# EasyEDA Pro project ProPrj_ProDoc_FPGA_2026-03-24.epro, schematic SCH_13, sheets 6 to 11 of 11

## Sheets
6 FPGA_ DDR3: Board Name: 第五版; Create Date: 2024-10-14; Page Name: FPGA_ DDR3; Project Name: FPGA+MCU核心板10-14; Schematic Name: SCH_10; Update Date: 2024-10-14
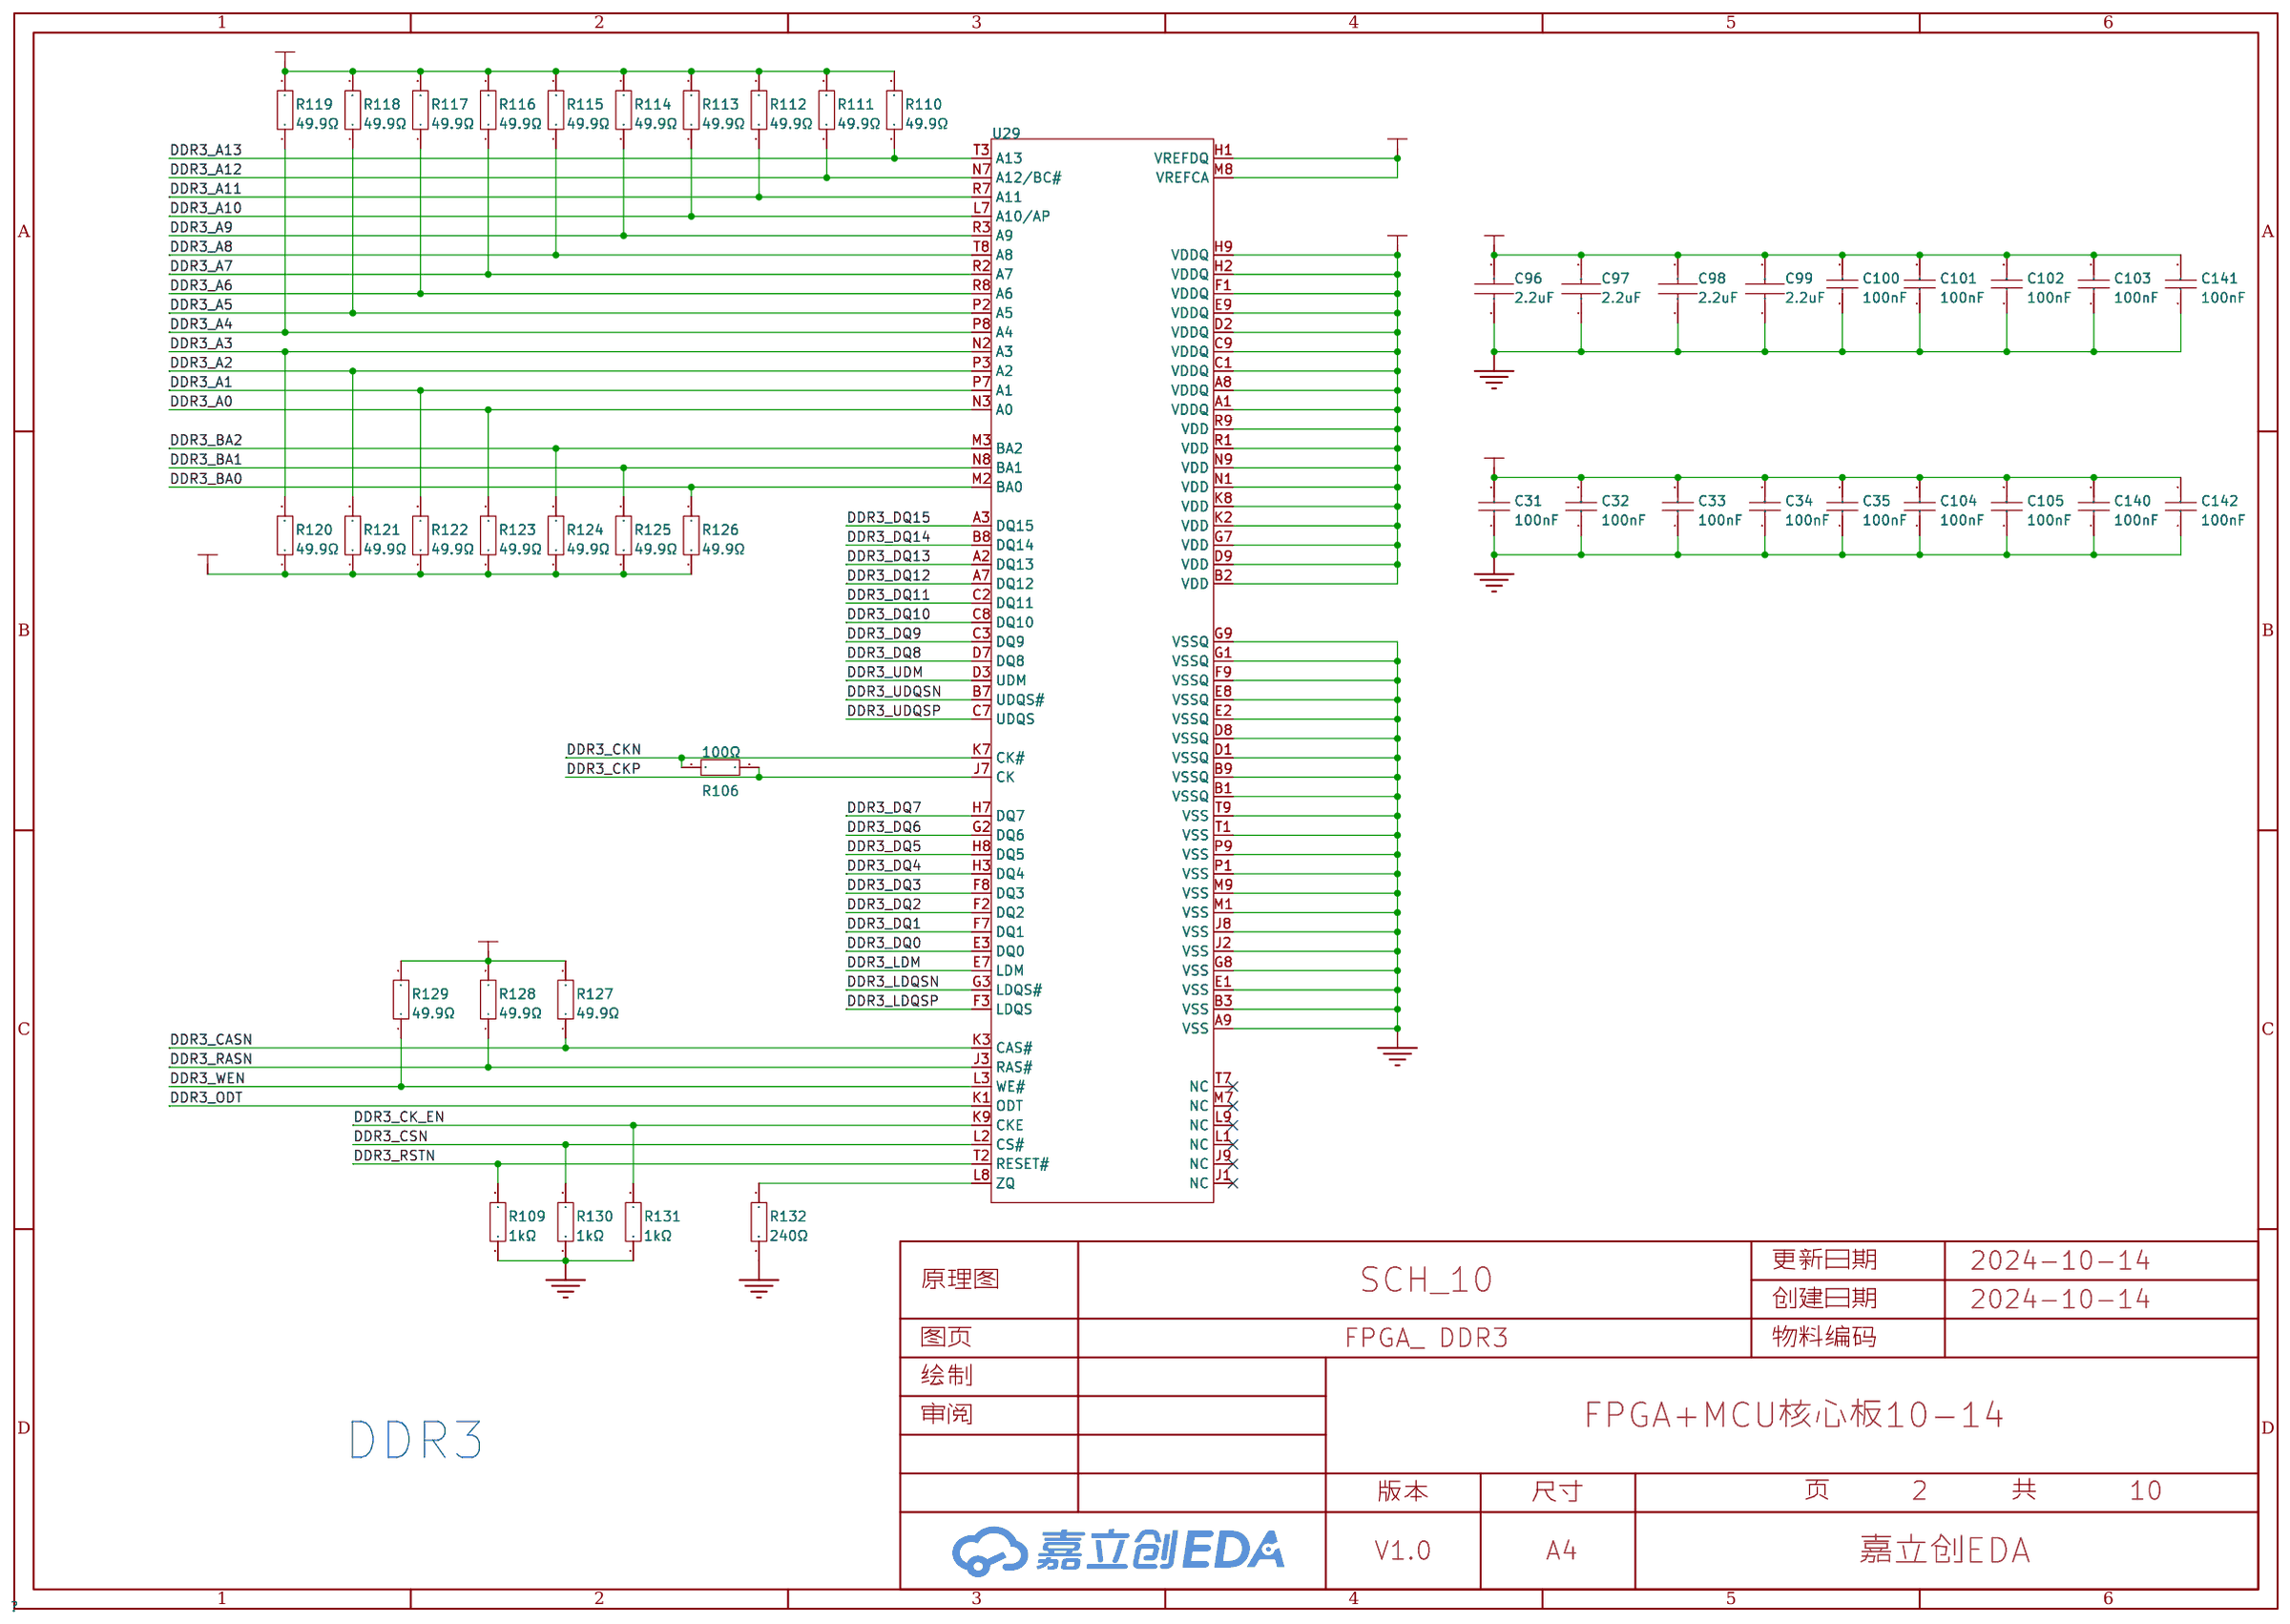
[diagram p5: FPGA_ DDR3]
7 FPGA_DDR3_Power
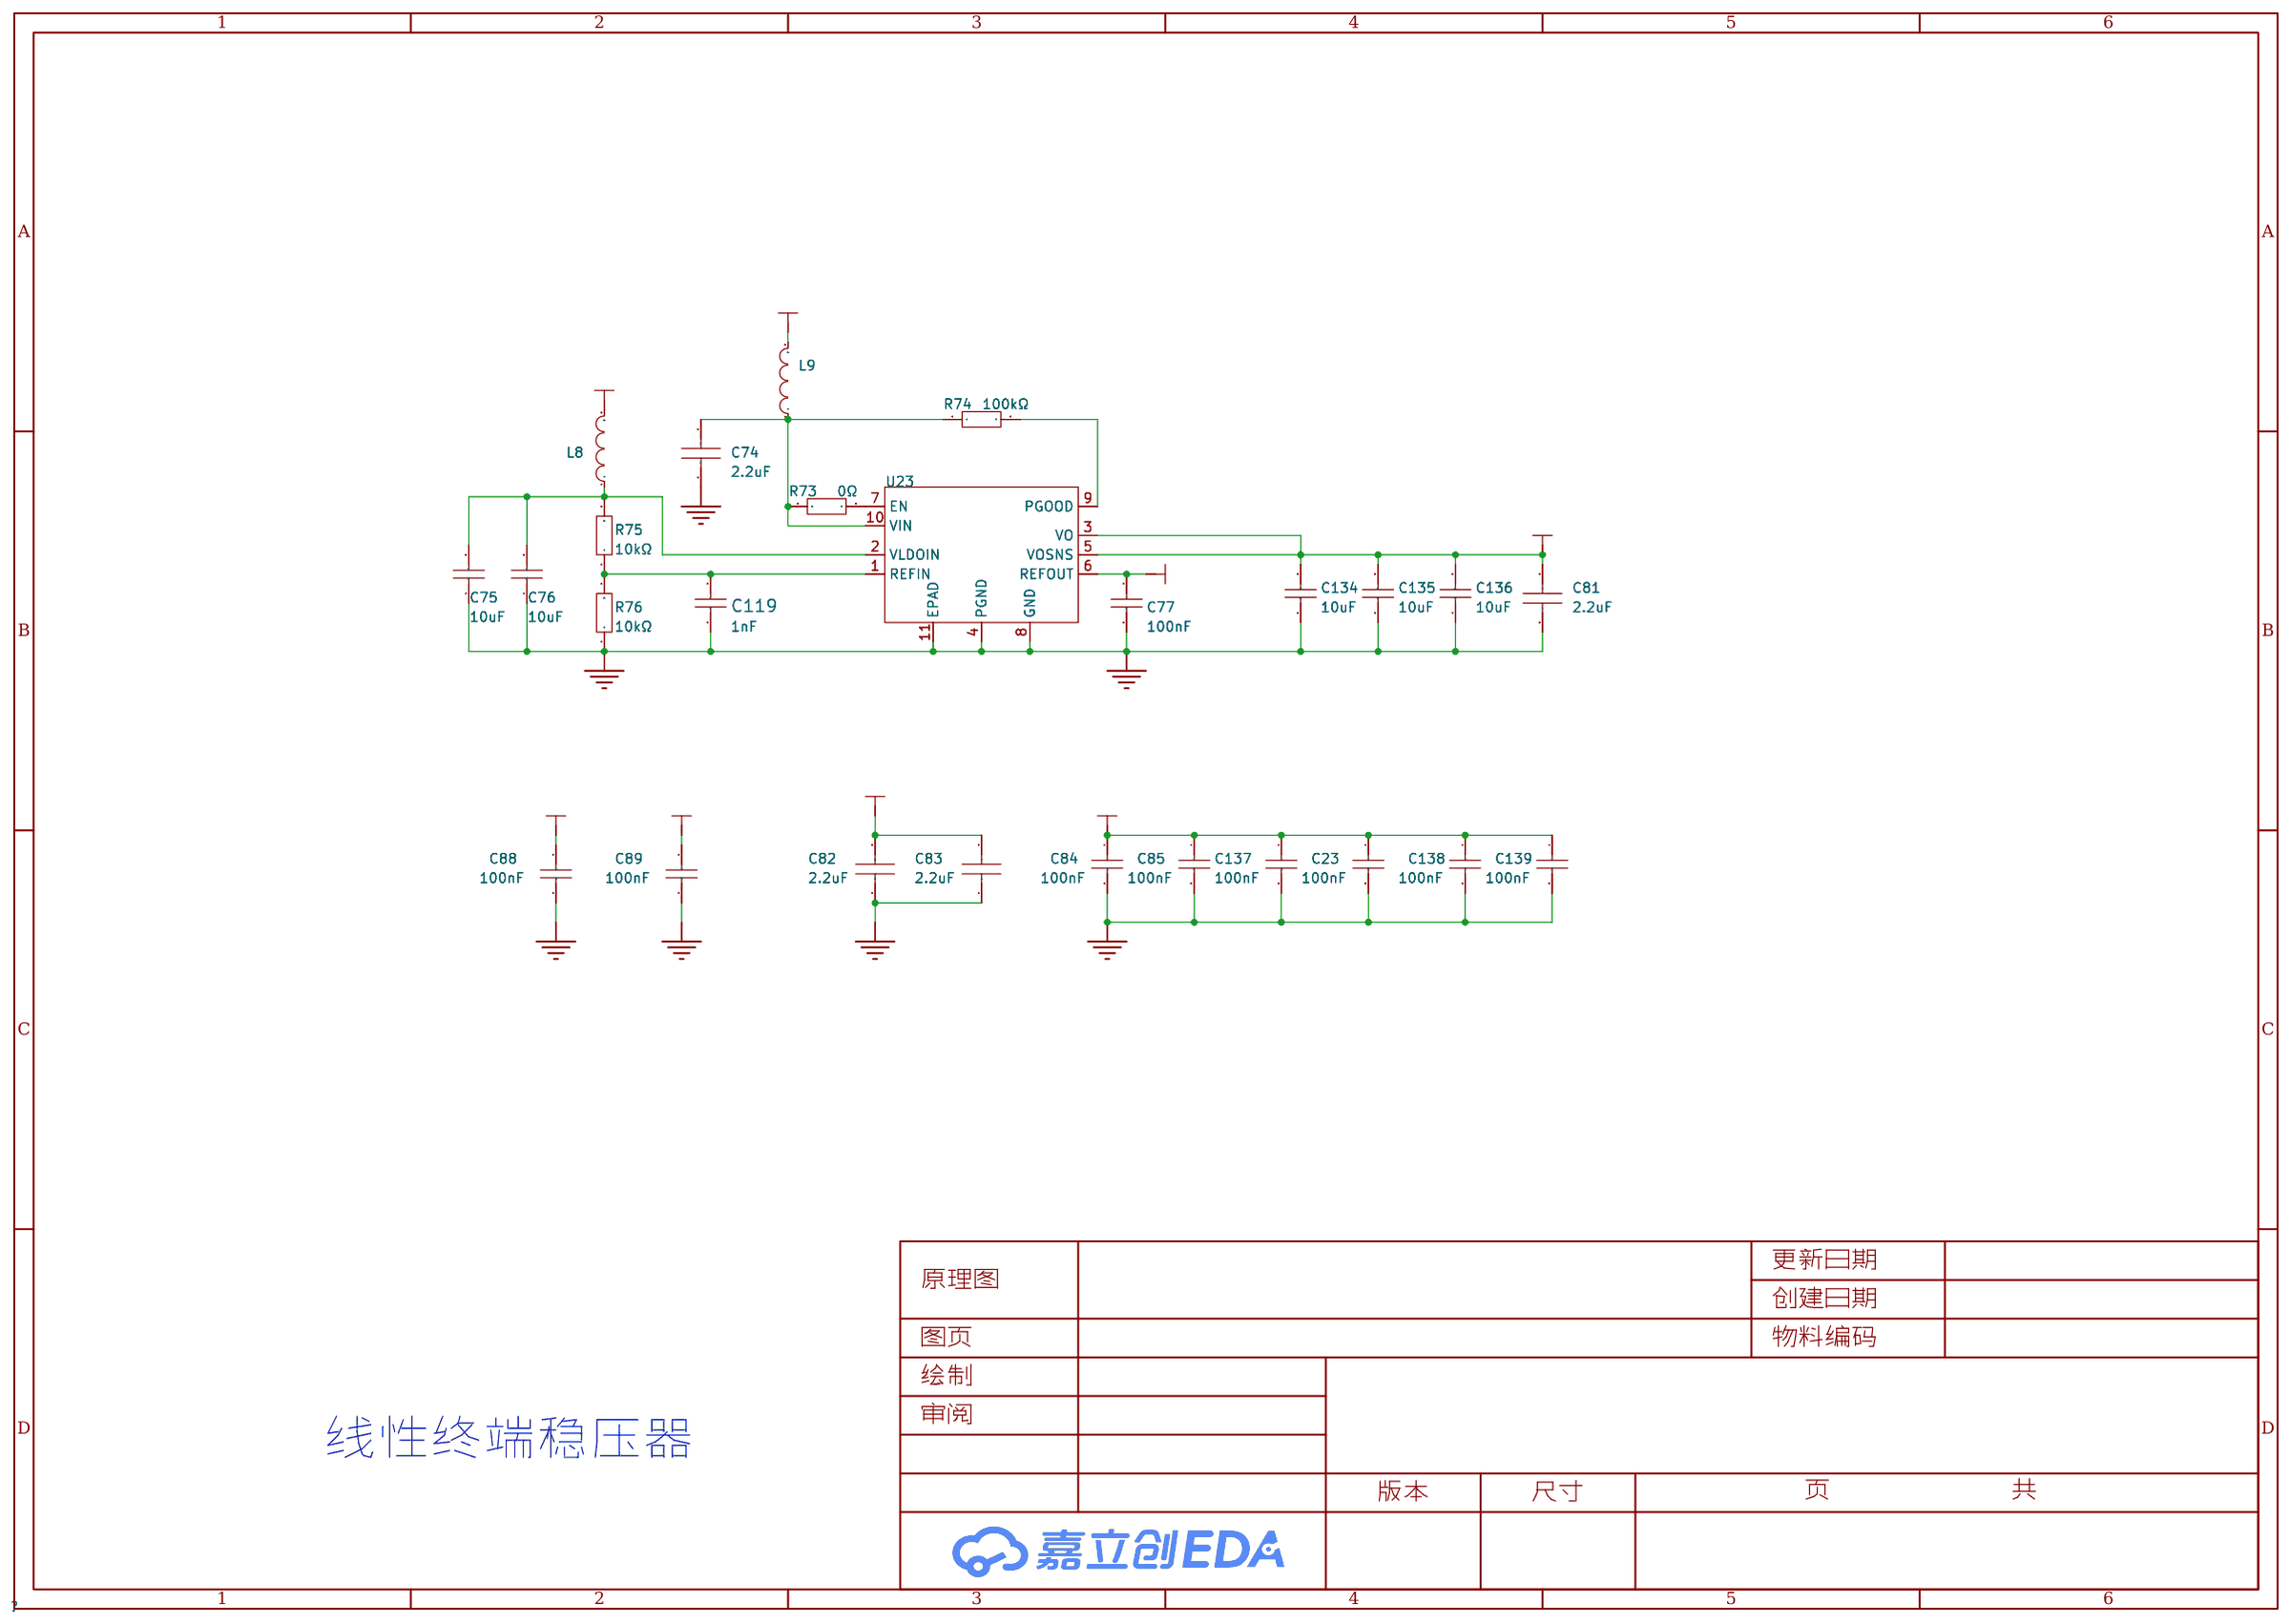
[diagram p6: FPGA_DDR3_Power]
8 FPGA_JTAG: Board Name: 第六版; Create Date: 2024-11-01; Page Name: FPGA_JTAG; Project Name: FPGA+MCU核心板; Update Date: 2024-11-01
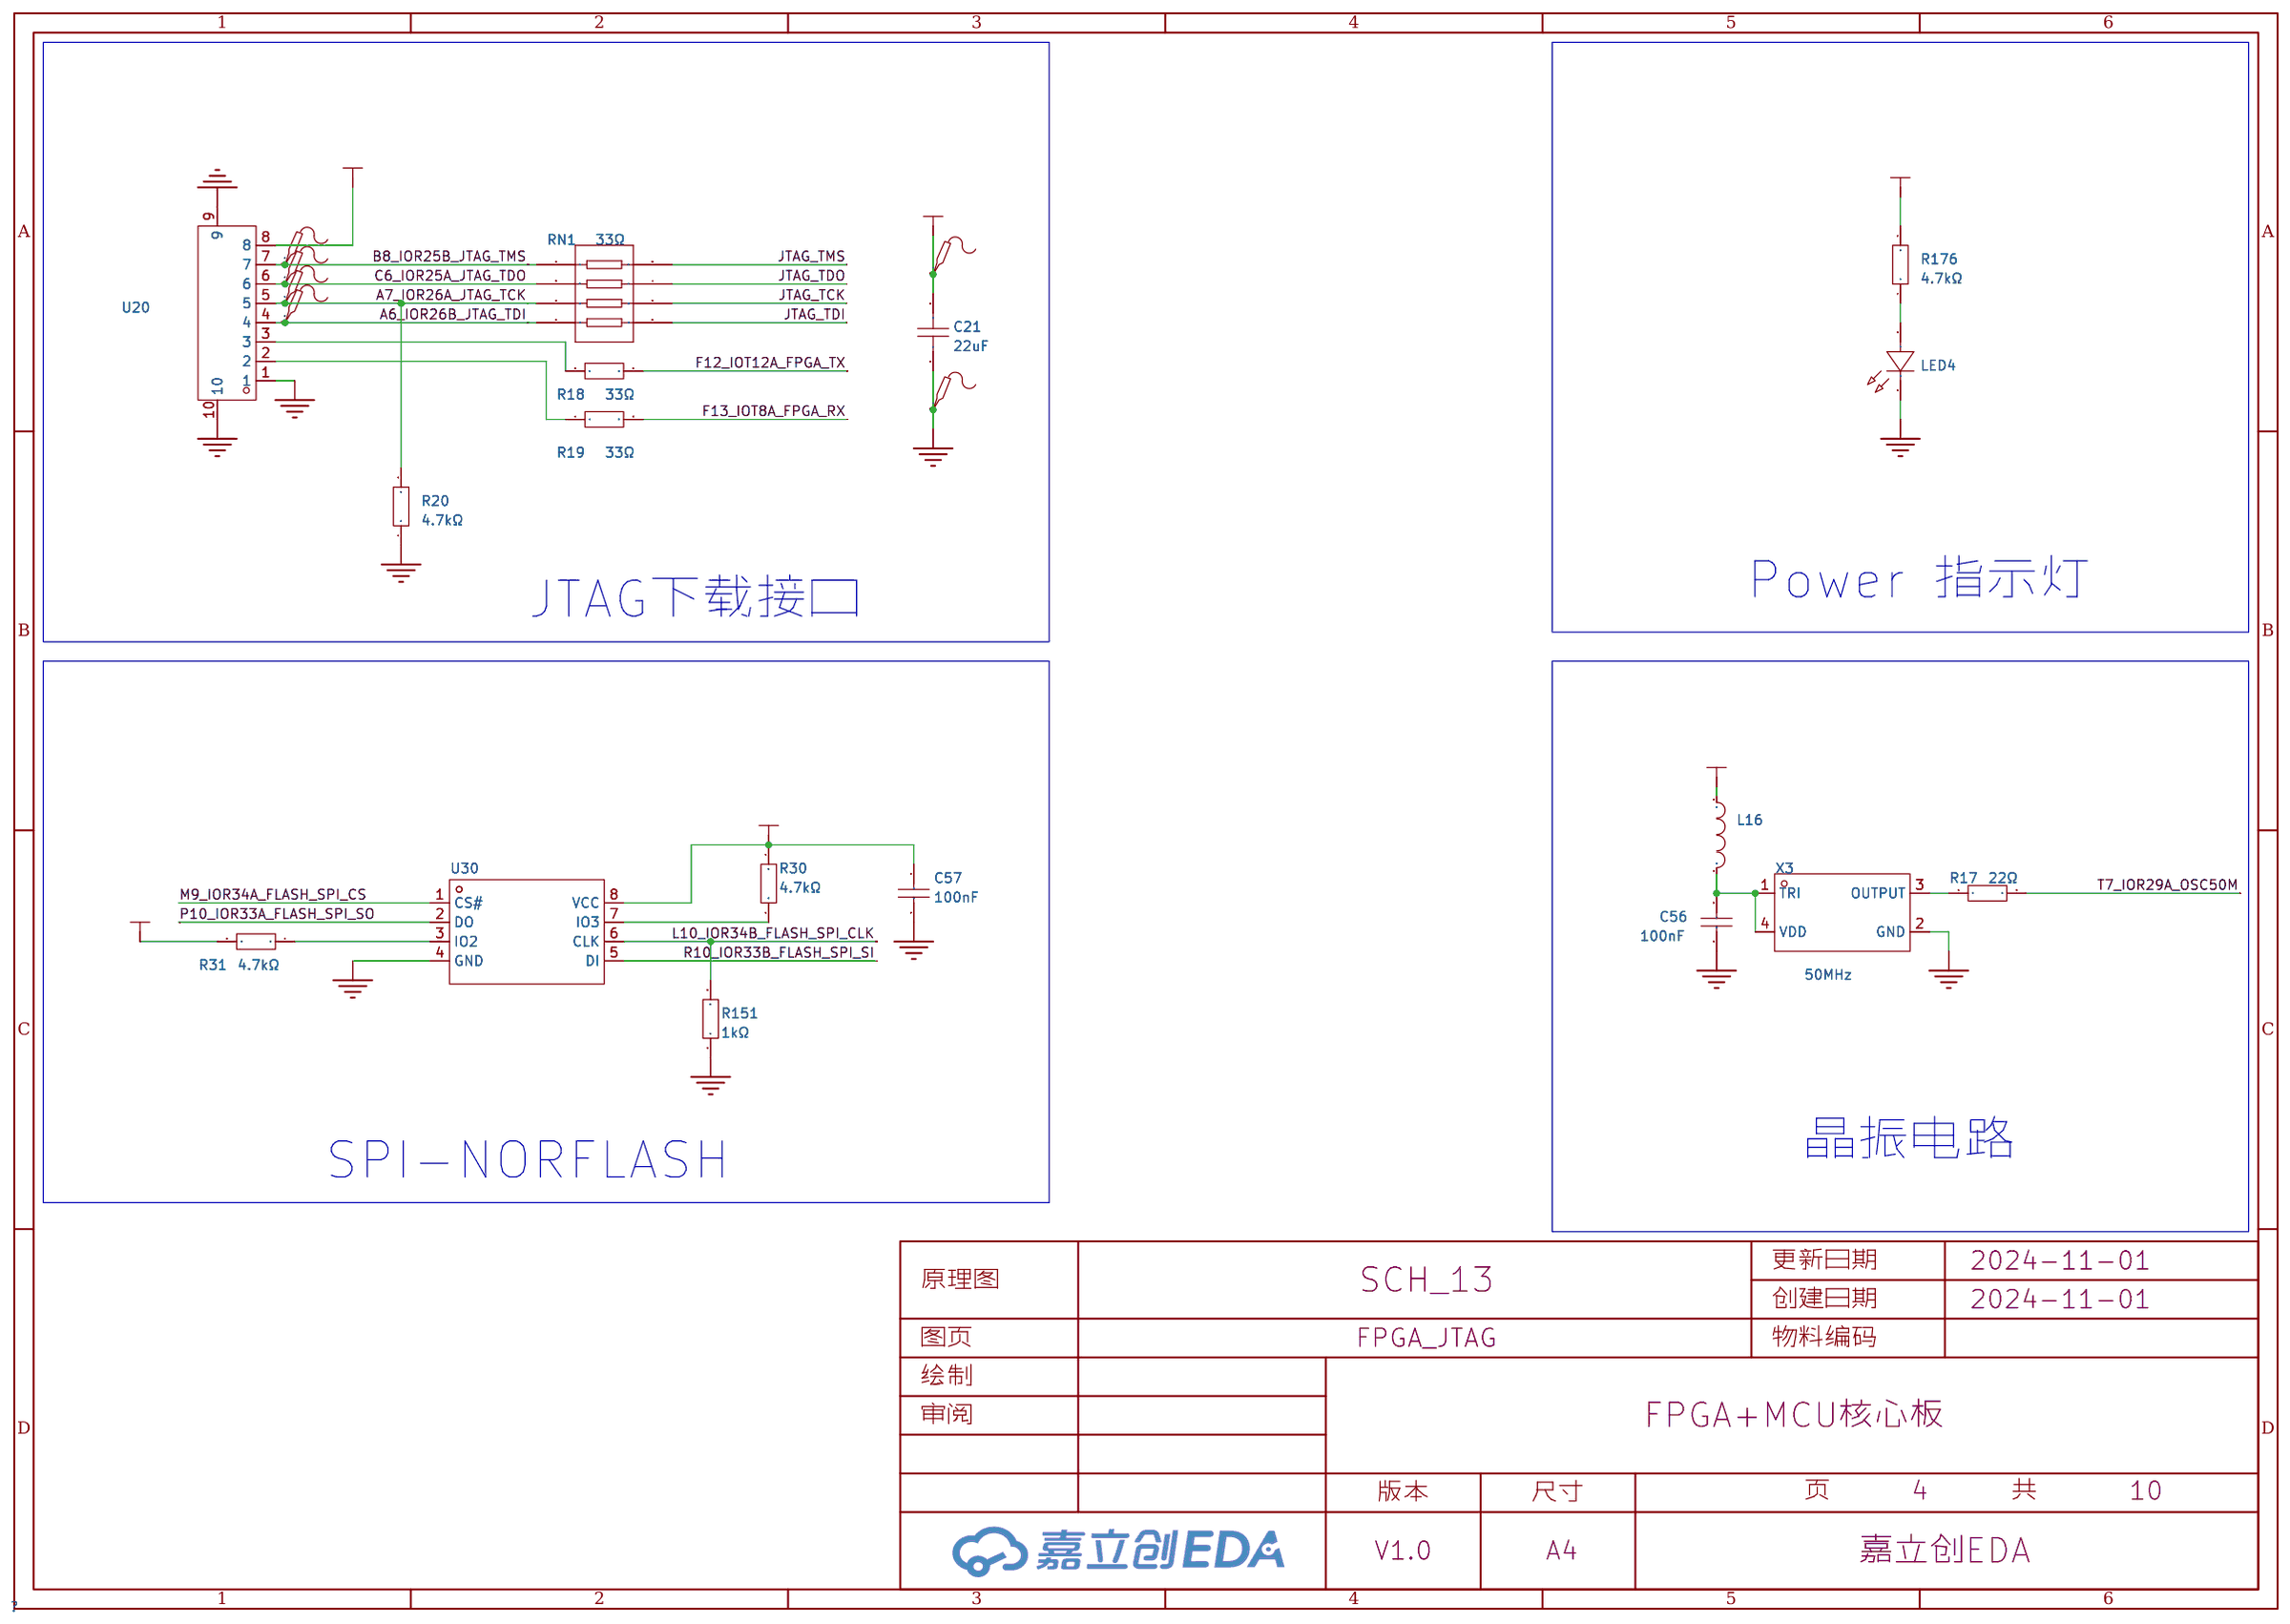
[diagram p7: FPGA_JTAG]
9 FPGA_HDMI: Create Date: 2026-03-06; Page Name: FPGA_HDMI; Update Date: 2026-03-06
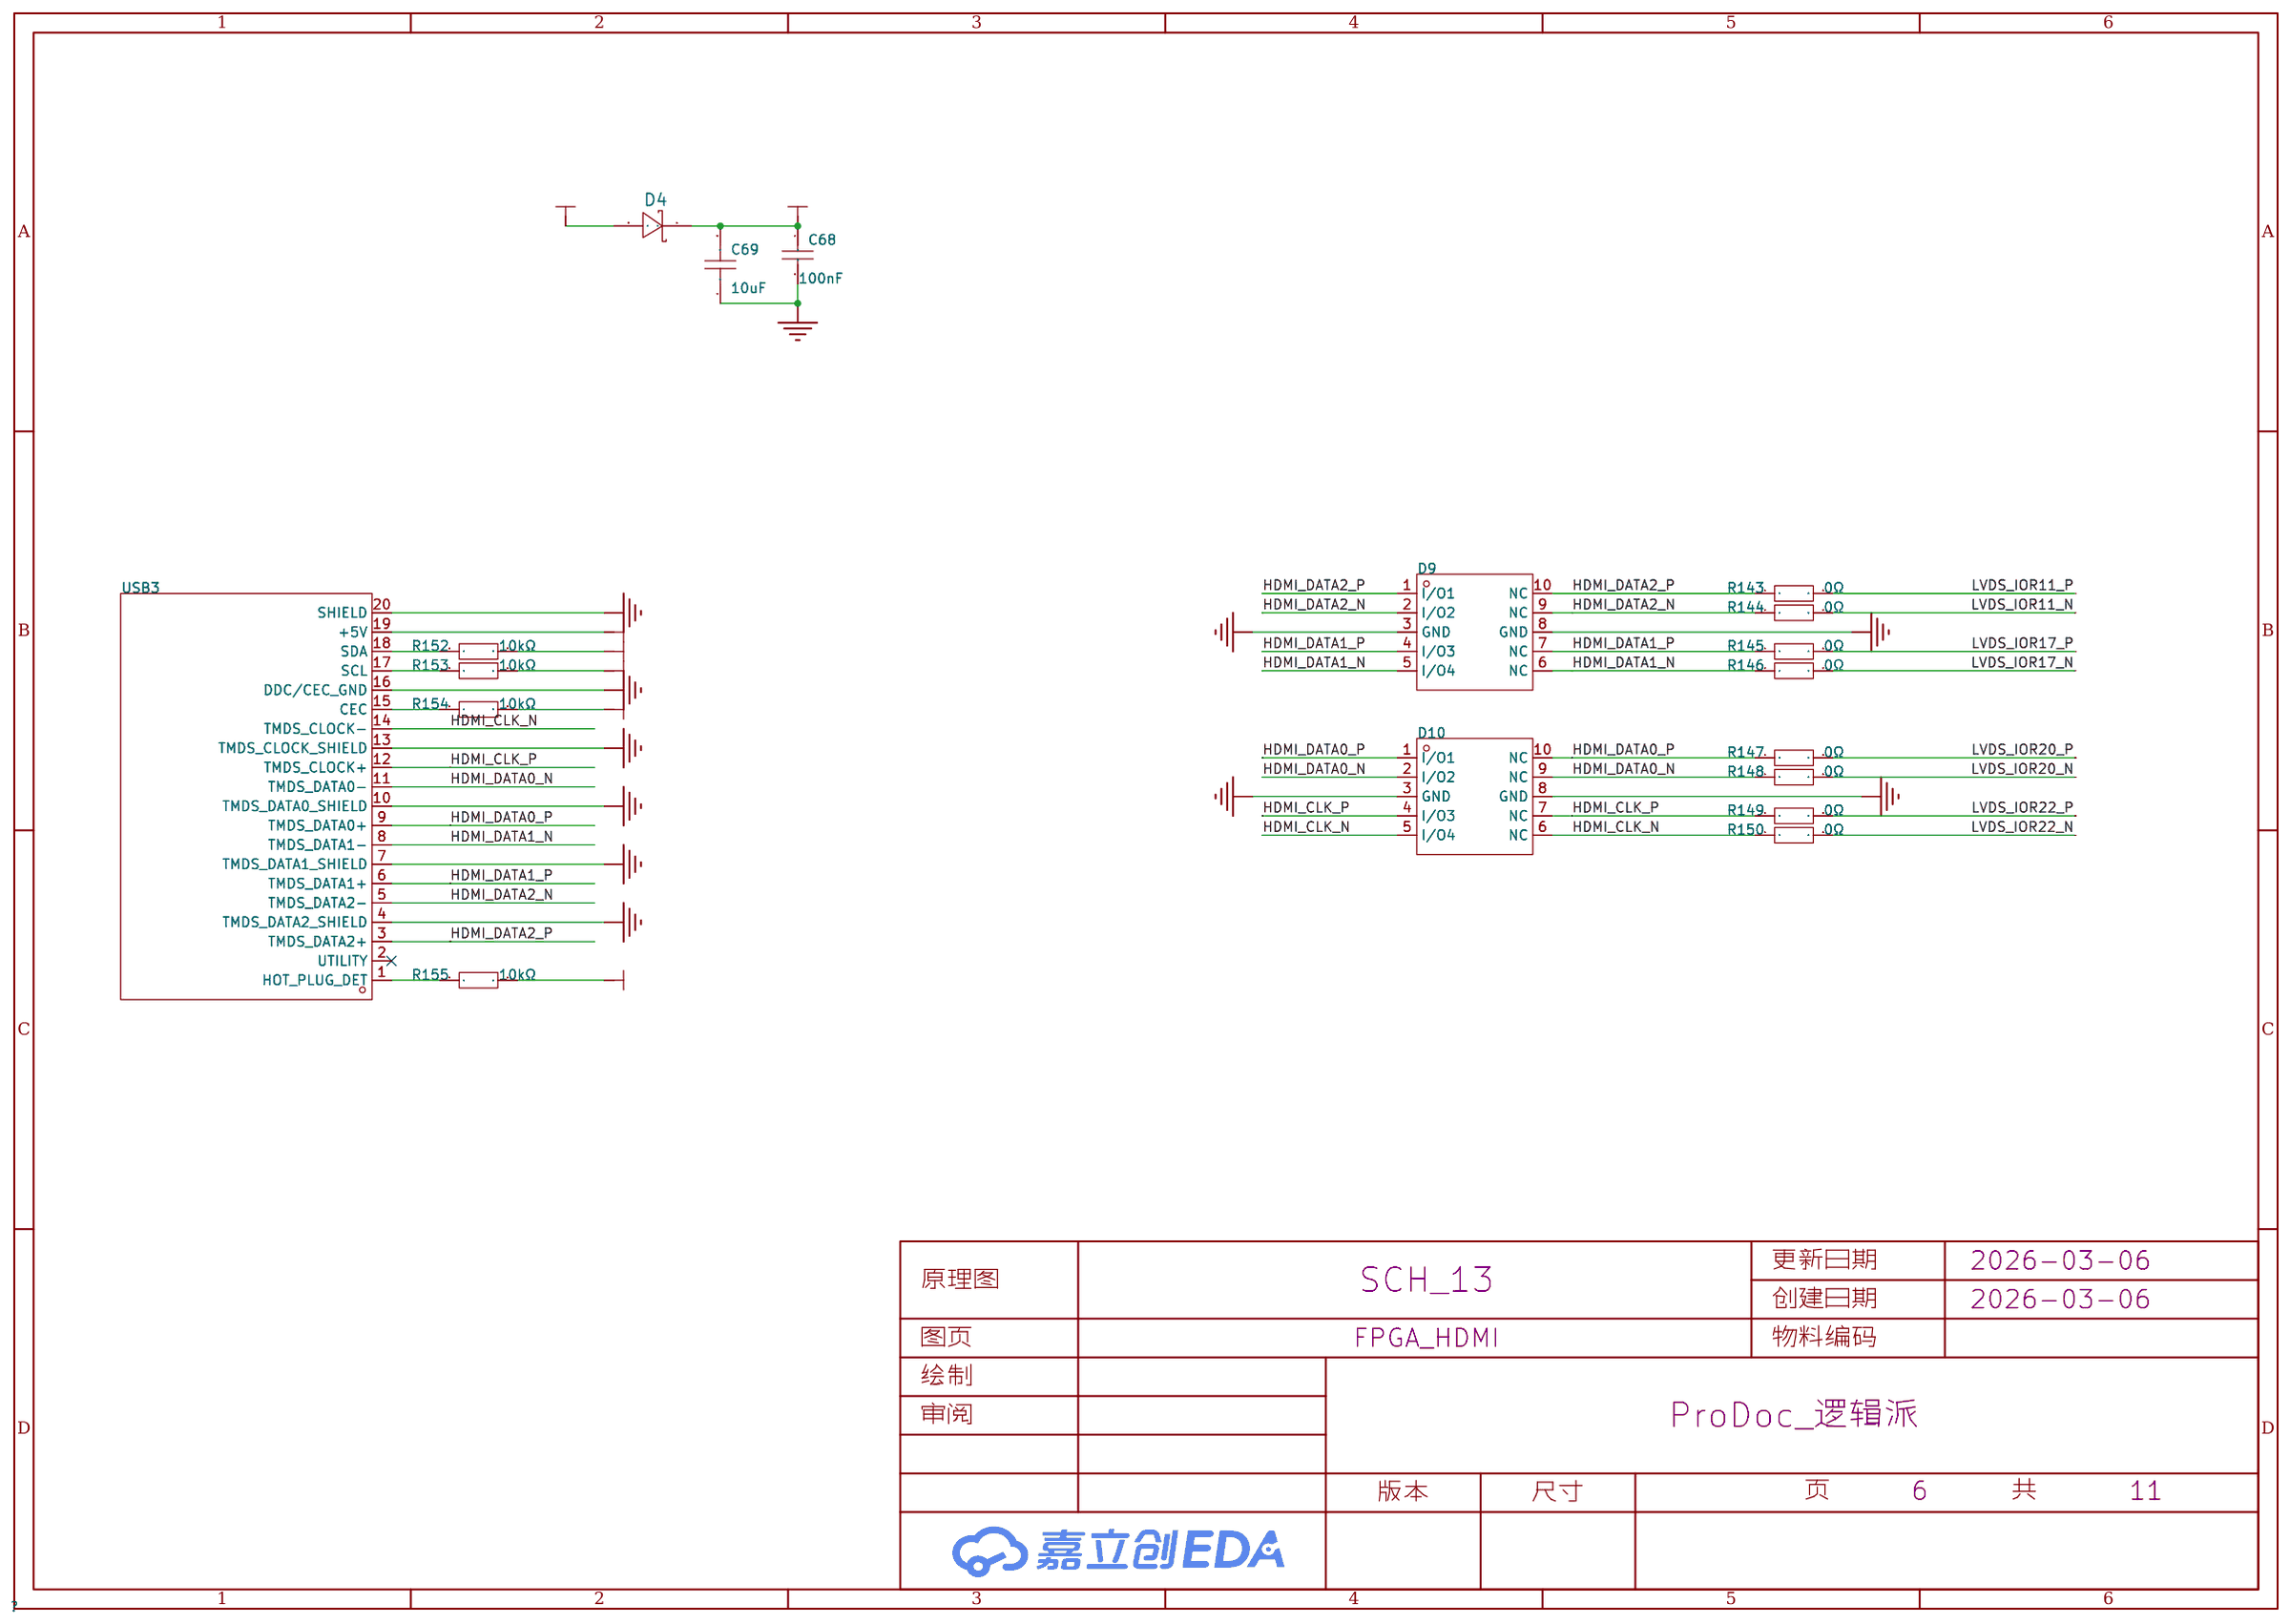
[diagram p8: FPGA_HDMI]
10 GD32_MicroSD: Board Name: 第六版; Create Date: 2024-11-01; Page Name: GD32_MicroSD; Project Name: FPGA+MCU核心板; Update Date: 2024-11-01
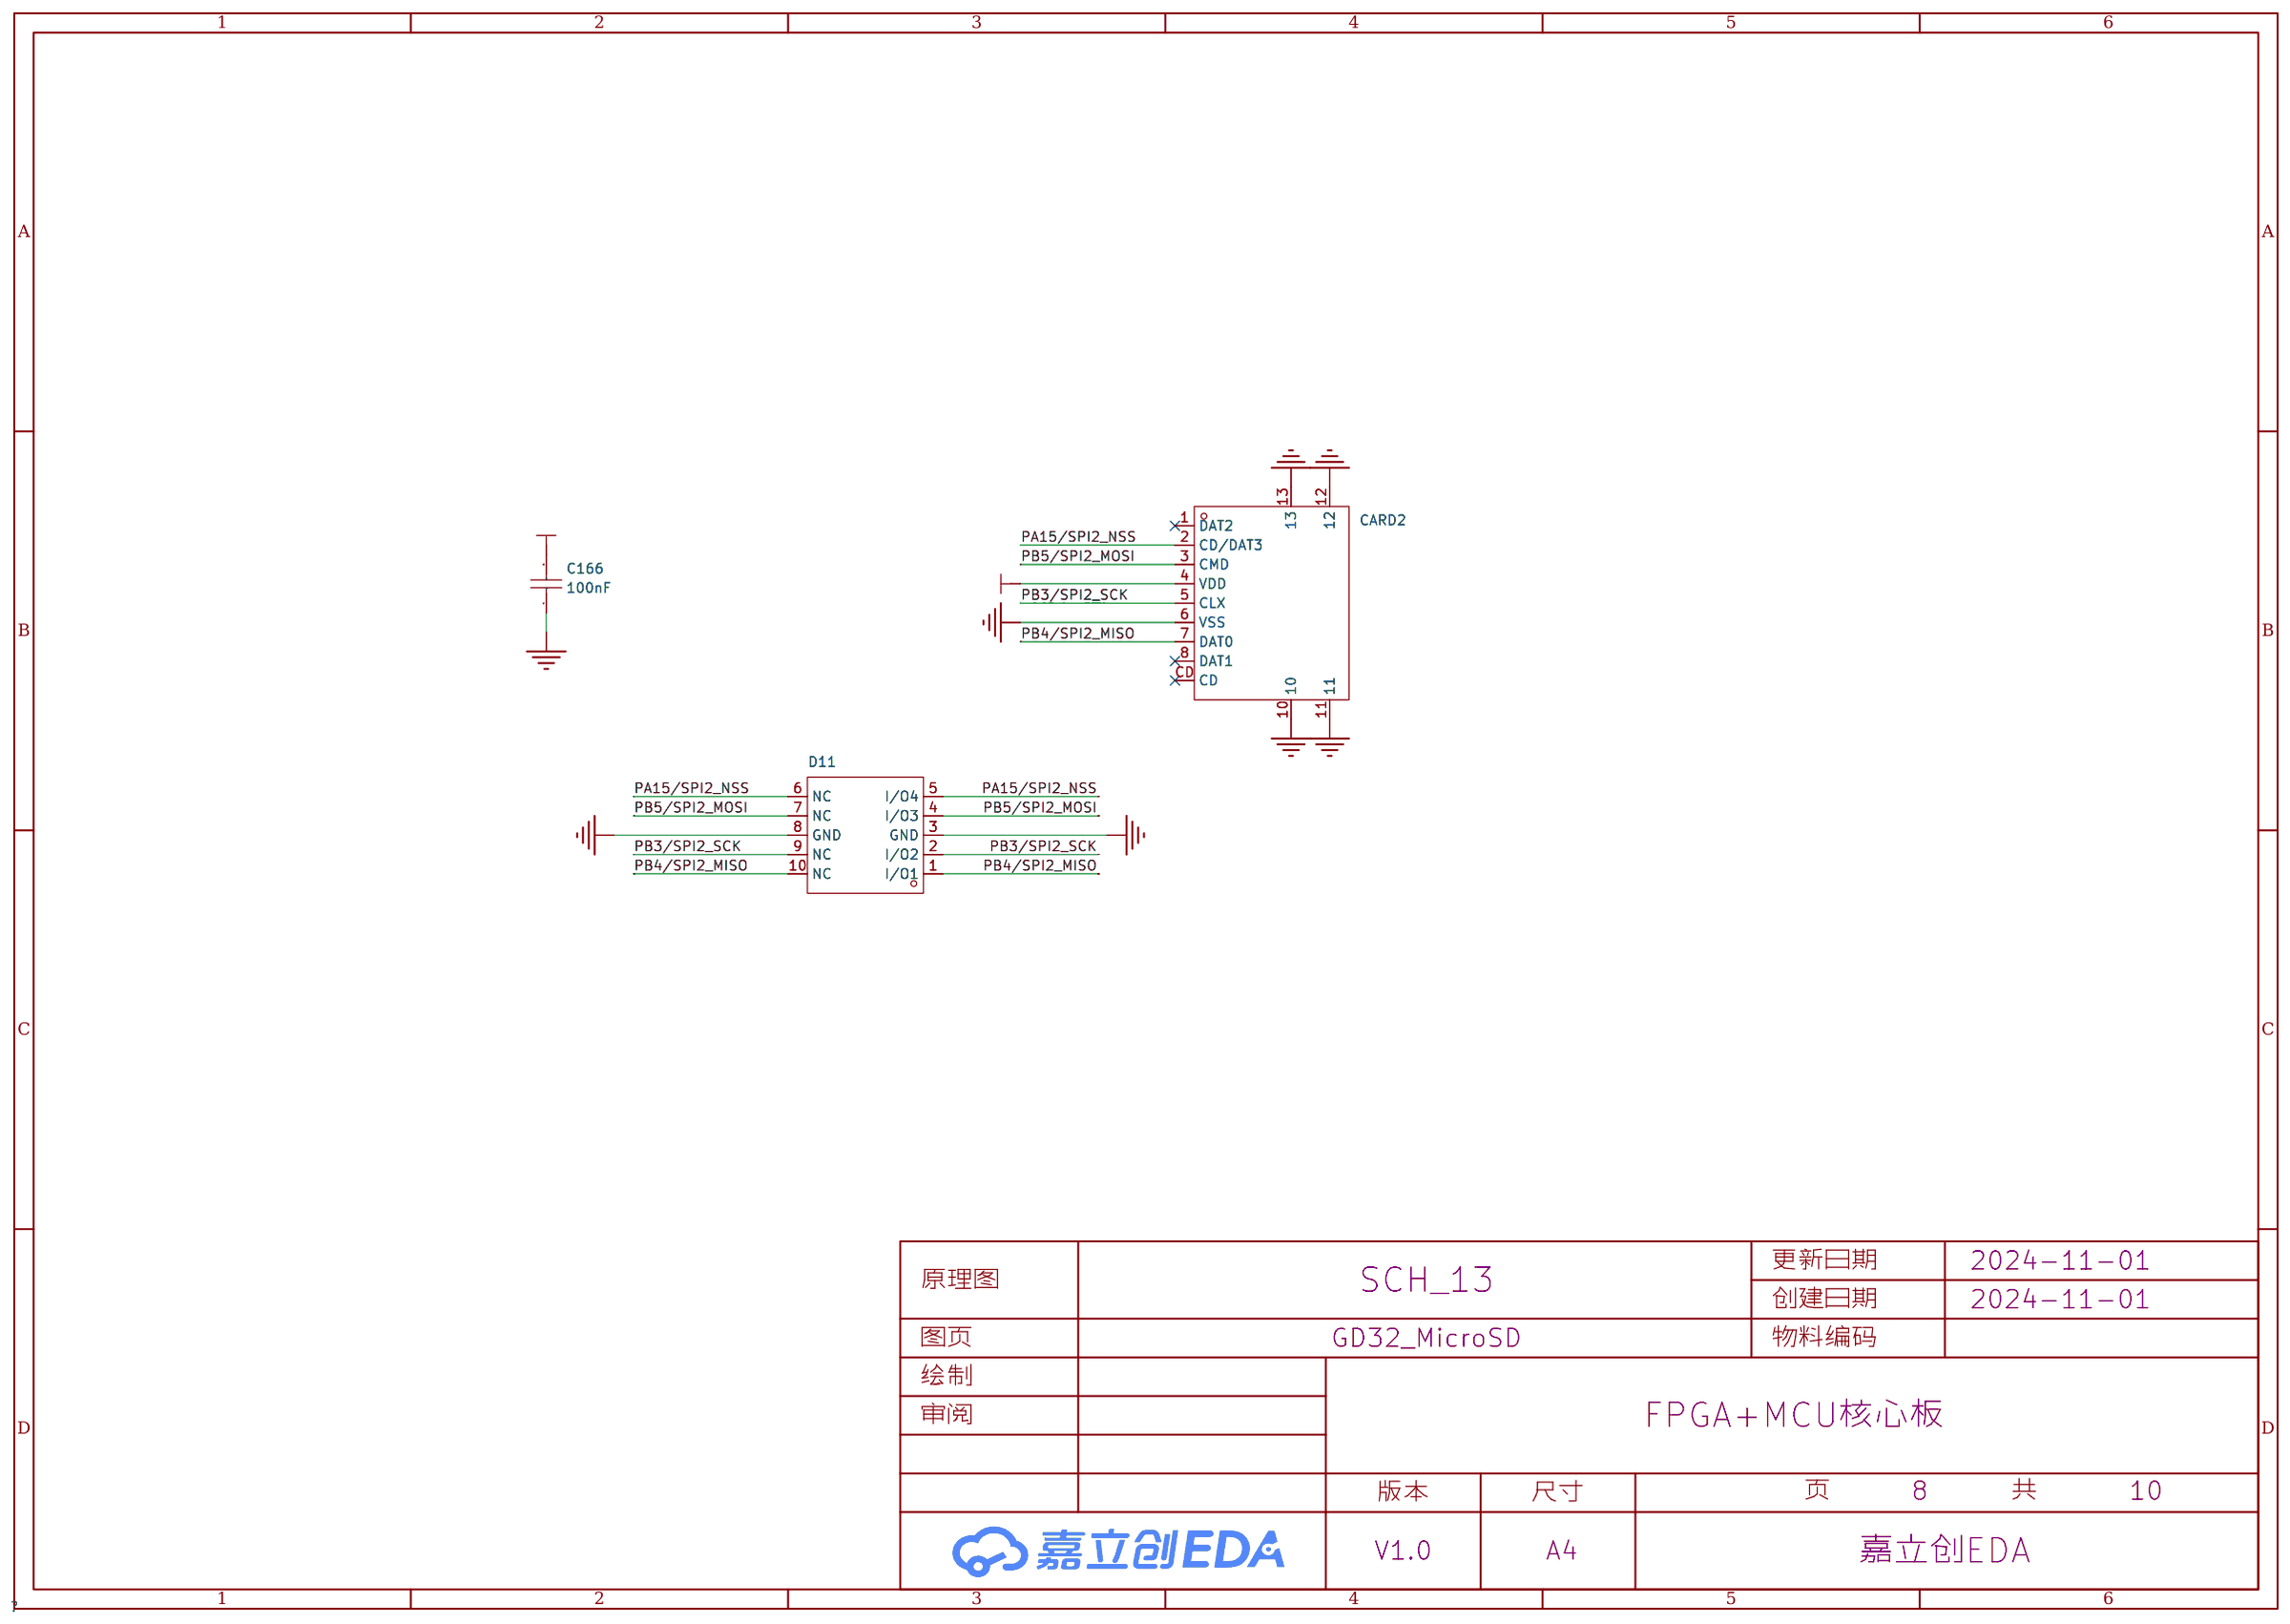
[diagram p9: GD32_MicroSD]
11 电源树: Create Date: 2026-03-06
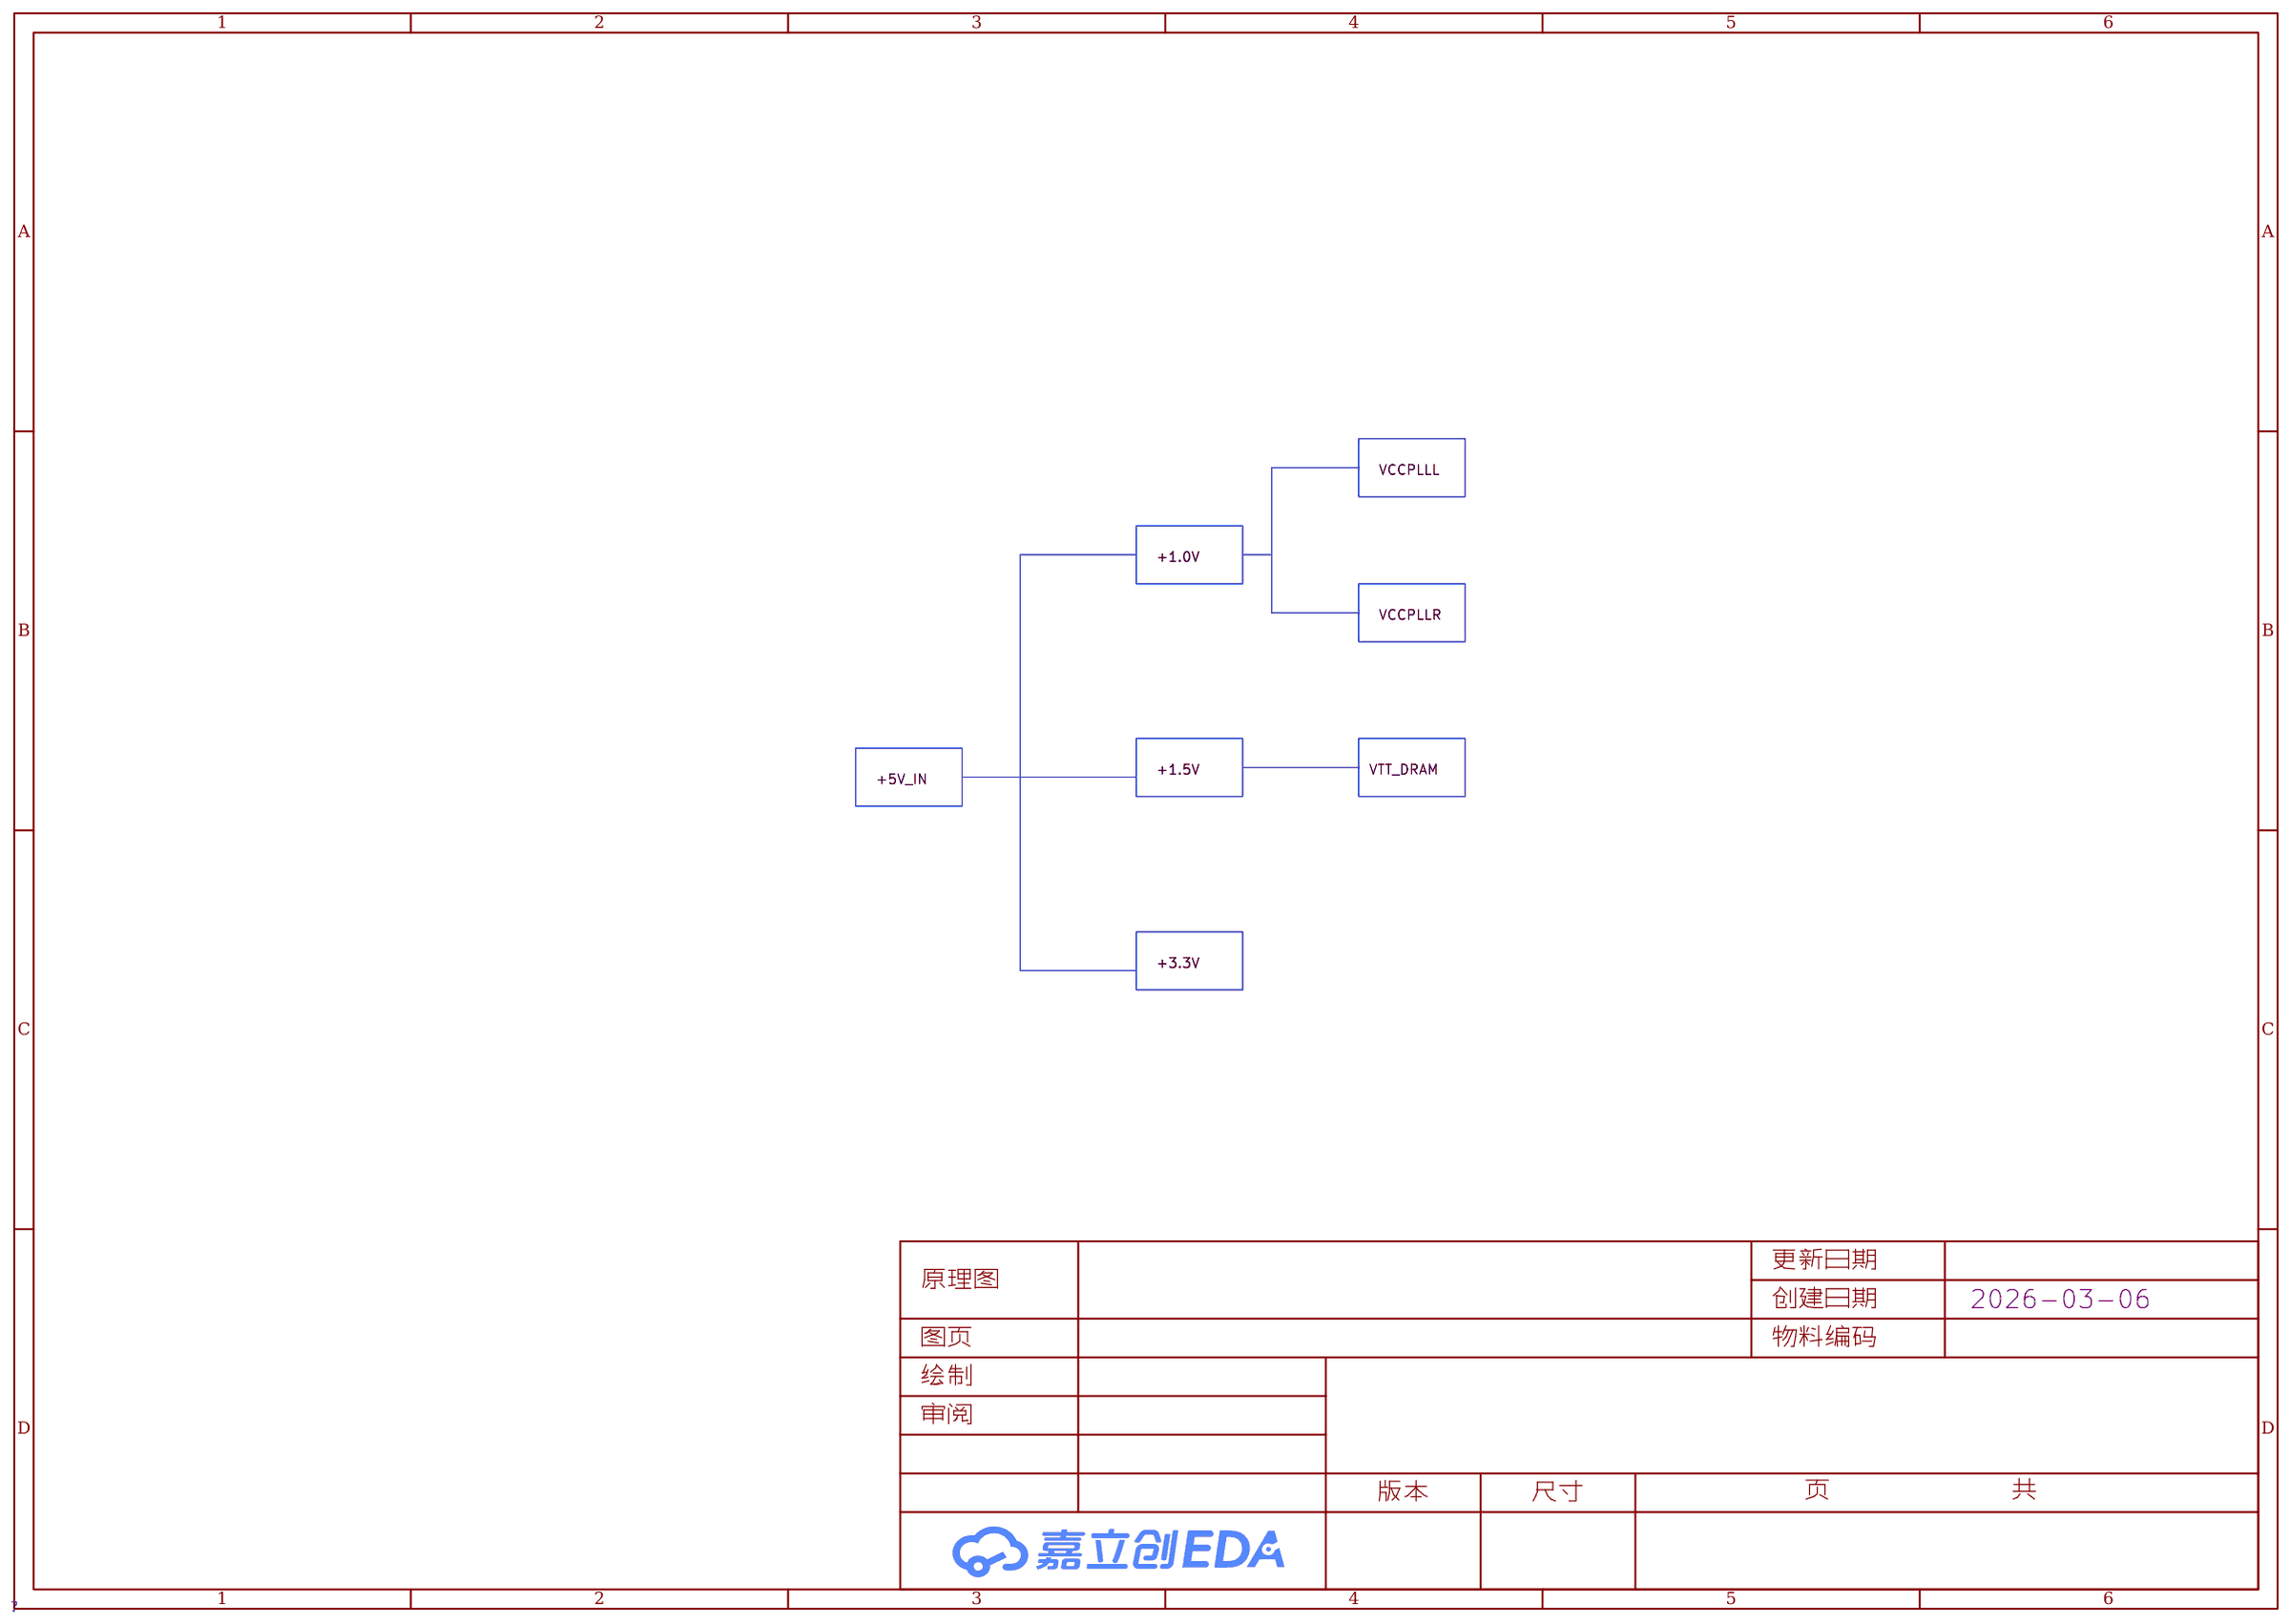
[diagram p10: 电源树]

## Parts
sheet FPGA_ DDR3
C31  100nF  [C0402]
C32  100nF  [C0402]
C33  100nF  [C0402]
C34  100nF  [C0402]
C35  100nF  [C0402]
C96  2.2uF  [C0402]
C97  2.2uF  [C0402]
C98  2.2uF  [C0402]
C99  2.2uF  [C0402]
C100  100nF  [C0402]
C101  100nF  [C0402]
C102  100nF  [C0402]
C103  100nF  [C0402]
C104  100nF  [C0402]
C105  100nF  [C0402]
C140  100nF  [C0402]
C141  100nF  [C0402]
C142  100nF  [C0402]
R106  100Ω  [R0402]
R109  1kΩ  [R0402]
R110  49.9Ω  [R0402]
R111  49.9Ω  [R0402]
R112  49.9Ω  [R0402]
R113  49.9Ω  [R0402]
R114  49.9Ω  [R0402]
R115  49.9Ω  [R0402]
R116  49.9Ω  [R0402]
R117  49.9Ω  [R0402]
R118  49.9Ω  [R0402]
R119  49.9Ω  [R0402]
R120  49.9Ω  [R0402]
R121  49.9Ω  [R0402]
R122  49.9Ω  [R0402]
R123  49.9Ω  [R0402]
R124  49.9Ω  [R0402]
R125  49.9Ω  [R0402]
R126  49.9Ω  [R0402]
R127  49.9Ω  [R0402]
R128  49.9Ω  [R0402]
R129  49.9Ω  [R0402]
R130  1kΩ  [R0402]
R131  1kΩ  [R0402]
R132  240Ω  [R0402]
U29  MT41J128M16JT-125-K  [FBGA-96_L14.0-W9.0-R16-C6-P0.80-TL]
sheet FPGA_DDR3_Power
C23  100nF  [C0402]
C74  2.2uF  [C0402]
C75  10uF  [C0402]
C76  10uF  [C0402]
C77  100nF  [C0402]
C81  2.2uF  [C0402]
C82  2.2uF  [C0402]
C83  2.2uF  [C0402]
C84  100nF  [C0402]
C85  100nF  [C0402]
C88  100nF  [C0402]
C89  100nF  [C0402]
C119  1nF  [C0402]
C134  10uF  [C0402]
C135  10uF  [C0402]
C136  10uF  [C0402]
C137  100nF  [C0402]
C138  100nF  [C0402]
C139  100nF  [C0402]
L8  MPZ1608S101ATAH0  [L0603]
L9  MPZ1608S101ATAH0  [L0603]
R73  0Ω  [R0402]
R74  100kΩ  [R0402]
R75  10kΩ  [R0402]
R76  10kΩ  [R0402]
U23  TPS51200DRCR  [WSON-10_L3.0-W3.0-P0.50-BL-EP]
sheet FPGA_HDMI
C68  100nF  [C0402]
C69  10uF  [C0603]
D4  1N5819WS  [SOD-323_L1.8-W1.3-LS2.5-RD]
D9  RCLAMP0524P  [DFN2510-10_L2.5-W1.0-P0.50-BL]
D10  RCLAMP0524P  [DFN2510-10_L2.5-W1.0-P0.50-BL]
R143  0Ω  [R0402]
R144  0Ω  [R0402]
R145  0Ω  [R0402]
R146  0Ω  [R0402]
R147  0Ω  [R0402]
R148  0Ω  [R0402]
R149  0Ω  [R0402]
R150  0Ω  [R0402]
R152  10kΩ  [R0402]
R153  10kΩ  [R0402]
R154  10kΩ  [R0402]
R155  10kΩ  [R0402]
USB3  -  [hdmi-smd_hdmi-101s]
sheet FPGA_JTAG
C21  22uF  [C0603]
C56  100nF  [C0402]
C57  100nF  [C0402]
L16  UPZ1005D121-1R3TF  [L0402]
LED4  F.0603.00139/P2-0603R1TS2-06T-002  [LED0603-RD]
R17  22Ω  [R0402]
R18  33Ω  [R0402]
R19  33Ω  [R0402]
R20  4.7kΩ  [R0402]
R30  4.7kΩ  [R0402]
R31  4.7kΩ  [R0402]
R151  1kΩ  [R0402]
R176  4.7kΩ  [R0603]
RN1  33Ω  [RES-ARRAY-SMD_0402-8P-L2.0-W1.0-BL]
TP11  -  [Test-Point-0.5mm]
TP12  -  [Test-Point-0.5mm]
TP13  -  [Test-Point-0.5mm]
TP14  -  [Test-Point-0.5mm]
TP15  -  [Test-Point-0.5mm]
TP16  -  [Test-Point-0.5mm]
U20  ZX-SH1.0-8PWT  [CONN-SMD_8P-P1.00_MEGASTAR_ZX-SH1.0-8PWT]
U30  W25Q64JVSSIQ  [SOP-8_L5.3-W5.3-P1.27-LS8.0-BL]
X3  50MHz  [OSC-SMD_4P-L3.2-W2.5-BL]
sheet GD32_MicroSD
C166  100nF  [C0402]
CARD2  TF PUSH  [TF-SMD_TF-PUSH]
D11  RCLAMP0524P  [DFN2510-10_L2.5-W1.0-P0.50-BL]

## Library data of the parts
C23 C31-C35 C56 C57 C68 C77 C84 C85 C88 C89 C100-C105 C137-C142 C166 = CL05B104KO5NNNC: 容值:100nF;精度:±10%;额定电压:16V;材质(温度系数):X7R;; LCSC Part Name: 100nF ±10% 16V; Supplier Part: C1525; Manufacturer: SAMSUNG(三星); Supplier Footprint: 0402; JLCPCB Part Class: 基础库; Datasheet: https://atta.szlcsc.com/upload/public/pdf/source/20160218/1457707763339.pdf; Supplier: LCSC; Tolerance: ±10%; Voltage Rated: 16V; Temperature Coefficient: X7R
C74 C81-C83 C96-C99 = CL05A225MQ5NSNC: 容值:2.2uF;精度:±20%;额定电压:6.3V;材质(温度系数):X5R;; LCSC Part Name: 2.2uF ±20% 6.3V; Supplier Part: C12530; Manufacturer: SAMSUNG(三星); Supplier Footprint: 0402; JLCPCB Part Class: 基础库; Datasheet: https://atta.szlcsc.com/upload/public/pdf/source/20160103/1457707666860.pdf; Supplier: LCSC; Tolerance: ±20%; Voltage Rated: 6.3V; Temperature Coefficient: X5R
R106 = 0402WGF1000TCE: 电阻类型:厚膜电阻;阻值:100Ω;精度:±1%;功率:62.5mW;温度系数:±200ppm/℃;; LCSC Part Name: 厚膜电阻 100Ω ±1% 62.5mW; Supplier Part: C25076; Manufacturer: UNI-ROYAL(厚声); Supplier Footprint: 0402; JLCPCB Part Class: 基础库; Datasheet: https://atta.szlcsc.com/upload/public/pdf/source/20200306/C422600_1E6D84923E4A46A82E41ADD87F860B5C.pdf; Supplier: LCSC; Type: 厚膜电阻; Tolerance: ±1%; Power(Watts): 62.5mW; Temperature Coefficient: ±200ppm/℃; Overload Voltage (Max): 50V; Operating Temperature Range: -55℃~+155℃
R109 R130 R131 R151 = 0402WGF1001TCE: 电阻类型:厚膜电阻;阻值:1kΩ;精度:±1%;功率:62.5mW;; LCSC Part Name: 1kΩ ±1% 62.5mW; Supplier Part: C11702; Manufacturer: UNI-ROYAL(厚声); Supplier Footprint: 0402; JLCPCB Part Class: 基础库; Datasheet: https://atta.szlcsc.com/upload/public/pdf/source/20200306/C422600_1E6D84923E4A46A82E41ADD87F860B5C.pdf; Supplier: LCSC; Type: 厚膜电阻; Tolerance: ±1%; Power(Watts): 62.5mW; Temperature Coefficient: ±100ppm/℃; Overload Voltage (Max): 50V; Operating Temperature Range: -55℃~+155℃
R110-R129 = 0402WGF499JTCE: 电阻类型:厚膜电阻;阻值:49.9Ω;精度:±1%;功率:62.5mW;温度系数:±100ppm/℃;; LCSC Part Name: 厚膜电阻 49.9Ω ±1% 62.5mW; Supplier Part: C25120; Manufacturer: UNI-ROYAL(厚声); Supplier Footprint: 0402; JLCPCB Part Class: 基础库; Datasheet: https://atta.szlcsc.com/upload/public/pdf/source/20200306/C422600_1E6D84923E4A46A82E41ADD87F860B5C.pdf; Supplier: LCSC; Type: 厚膜电阻; Tolerance: ±1%; Power(Watts): 62.5mW; Temperature Coefficient: ±100ppm/℃; Overload Voltage (Max): 50V; Operating Temperature Range: -55℃~+155℃
R132 = 0402WGF2400TCE: 电阻类型:厚膜电阻;阻值:240Ω;精度:±1%;功率:62.5mW;温度系数:±100ppm/℃;; LCSC Part Name: 厚膜电阻 240Ω ±1% 62.5mW; Supplier Part: C25094; Manufacturer: UNI-ROYAL(厚声); Supplier Footprint: 0402; JLCPCB Part Class: 扩展库; Datasheet: https://atta.szlcsc.com/upload/public/pdf/source/20200306/C422600_1E6D84923E4A46A82E41ADD87F860B5C.pdf; Supplier: LCSC; Type: 厚膜电阻; Tolerance: ±1%; Power(Watts): 62.5mW; Temperature Coefficient: ±100ppm/℃; Overload Voltage (Max): 50V; Operating Temperature Range: -55℃~+155℃
U29 = MT41J128M16JT-125-K: LCSC Part Name: MT41J128M16JT-125:K; Supplier Part: C5128616; Manufacturer: micron(镁光); Supplier Footprint: FBGA-96; JLCPCB Part Class: 扩展库; Datasheet: https://atta.szlcsc.com/upload/public/pdf/source/20220810/F0A01CE8EB48673B41D7B913ED7D9A50.pdf; Supplier: LCSC
C75 C76 C134-C136 = CL05A106MQ5NUNC: 容值:10uF;精度:±20%;额定电压:6.3V;材质(温度系数):X5R;; LCSC Part Name: 10uF ±20% 6.3V; Supplier Part: C15525; Manufacturer: SAMSUNG(三星); Supplier Footprint: 0402; JLCPCB Part Class: Basic Part; Datasheet: https://atta.szlcsc.com/upload/public/pdf/source/20220823/2B02EE04F8F211D38A52DCB16EB6BEBA.pdf; Supplier: LCSC; Tolerance: ±20%; Voltage Rated: 6.3V; Temperature Coefficient: X5R
C119 = 0402B102K500NT: 容值:1nF;精度:±10%;额定电压:50V;材质(温度系数):X7R;; LCSC Part Name: 1nF ±10% 50V; Supplier Part: C1523; Manufacturer: FH(风华); Supplier Footprint: 0402; JLCPCB Part Class: 基础库; Datasheet: https://atta.szlcsc.com/upload/public/pdf/source/20200305/C486355_26A10D38EF8C2A5C37091D0039909270.pdf; Supplier: LCSC; Tolerance: ±10%; Voltage Rated: 50V; Temperature Coefficient: X7R
L8 L9 = MPZ1608S101ATAH0: 标称阻抗@测试频率:100Ω@100MHz;误差:±25%;直流电阻(RDC):30mΩ;额定电流:3A;电路数:1;; LCSC Part Name: 100Ω@100MHz ±25%; Supplier Part: C107332; Manufacturer: TDK; Supplier Footprint: SMD; JLCPCB Part Class: 扩展库; Datasheet: https://atta.szlcsc.com/upload/public/pdf/source/20170420/1492670790894.pdf; Supplier: LCSC; Impedance @ Frequency: 100Ω@100MHz; Tolerance: ±25%; DC Resistance: 30mΩ; Current Rating: 3A; Circuits: 1
R73 R143-R150 = 0402WGF0000TCE: 电阻类型:厚膜电阻;阻值:0Ω;精度:±1%;功率:62.5mW;; LCSC Part Name: 0Ω ±1% 62.5mW; Supplier Part: C17168; Manufacturer: UNI-ROYAL(厚声); Supplier Footprint: 0402; JLCPCB Part Class: 基础库; Datasheet: https://atta.szlcsc.com/upload/public/pdf/source/20200306/C422600_1E6D84923E4A46A82E41ADD87F860B5C.pdf; Supplier: LCSC; Type: 厚膜电阻; Tolerance: ±1%; Power(Watts): 62.5mW; Temperature Coefficient: ±800ppm/℃; Overload Voltage (Max): 50V; Operating Temperature Range: -55℃~+155℃
R74 = 0402WGF1003TCE: 电阻类型:厚膜电阻;阻值:100kΩ;精度:±1%;功率:62.5mW;; LCSC Part Name: 100kΩ ±1% 62.5mW; Supplier Part: C25741; Manufacturer: UNI-ROYAL(厚声); Supplier Footprint: 0402; JLCPCB Part Class: Basic Part; Datasheet: https://atta.szlcsc.com/upload/public/pdf/source/20200306/C422600_1E6D84923E4A46A82E41ADD87F860B5C.pdf; Supplier: LCSC; Type: 厚膜电阻; Tolerance: ±1%; Power(Watts): 62.5mW; Temperature Coefficient: ±100ppm/℃; Overload Voltage (Max): 50V; Operating Temperature Range: -55℃~+155℃
R75 R76 R152-R155 = 0402WGF1002TCE: 电阻类型:厚膜电阻;阻值:10kΩ;精度:±1%;功率:62.5mW;温度系数:±100ppm/℃;; LCSC Part Name: 厚膜电阻 10kΩ ±1% 62.5mW; Supplier Part: C25744; Manufacturer: UNI-ROYAL(厚声); Supplier Footprint: 0402; JLCPCB Part Class: 基础库; Datasheet: https://atta.szlcsc.com/upload/public/pdf/source/20200306/C422600_1E6D84923E4A46A82E41ADD87F860B5C.pdf; Supplier: LCSC; Type: 厚膜电阻; Tolerance: ±1%; Power(Watts): 62.5mW; Temperature Coefficient: ±100ppm/℃; Overload Voltage (Max): 50V; Operating Temperature Range: -55℃~+155℃
U23 = TPS51200DRCR: 输出电压:-;; Supplier: LCSC; Manufacturer: TI(德州仪器); Supplier Part: C34771; JLCPCB Part Class: 扩展库; Supplier Footprint: DFN-10(3x3); Datasheet: https://www.ti.com/cn/lit/gpn/tps51200; Number of Outputs: 1; Operating Temperature: -40℃~+85℃
C69 = CL10A106KP8NNNC: 容值:10uF;精度:±10%;额定电压:10V;材质(温度系数):X5R;; LCSC Part Name: 10uF ±10% 10V; Supplier Part: C19702; Manufacturer: SAMSUNG(三星); Supplier Footprint: 0603; JLCPCB Part Class: 基础库; Datasheet: https://atta.szlcsc.com/upload/public/pdf/source/20160103/1457707703378.pdf; Supplier: LCSC; Tolerance: ±10%; Voltage Rated: 10V; Temperature Coefficient: X5R
D4 = 1N5819WS_C191023: 直流反向耐压(Vr):40V;平均整流电流(Io):1A;正向压降(Vf):600mV@1A;; LCSC Part Name: 40V 1A 600mV@1A; Supplier Part: C191023; Manufacturer: Hottech(合科泰); Supplier Footprint: SOD-323; JLCPCB Part Class: 基础库; Datasheet: https://atta.szlcsc.com/upload/public/pdf/source/20220428/3CB86FD8D28D653594B4E35F9D5AEFD9.pdf; Supplier: LCSC; Reverse Voltage (Vr): 40V; Average Rectified Current (Io): 1A; Forward Voltage (Vf@If): 600mV@1A
D9-D11 = RCLAMP0524P_C907837: Supplier Part: C907837; Manufacturer: TECH PUBLIC(台舟); Supplier Footprint: DFN2510-10; JLCPCB Part Class: Extended Part; Datasheet: https://atta.szlcsc.com/upload/public/pdf/source/20210810/AE3DE9AC94AD2A317FD9BEA10653400F.pdf; Supplier: LCSC
USB3 = HDMI-101S: Supplier: LCSC; Supplier Part: C720620; Manufacturer: XUNPU(讯普)
C21 = GRM188R61A226ME15D: 容值:22uF;精度:±20%;额定电压:10V;材质(温度系数):X5R;; LCSC Part Name: 22uF ±20% 10V; Supplier Part: C84419; Manufacturer: muRata(村田); Supplier Footprint: 0603; JLCPCB Part Class: 扩展库; Datasheet: https://atta.szlcsc.com/upload/public/pdf/source/20161024/1477288637384.pdf; Supplier: LCSC; Tolerance: ±20%; Voltage Rated: 10V; Temperature Coefficient: X5R
L16 = UPZ1005D121-1R3TF: 标称阻抗@测试频率:120Ω@100MHz;误差:±25%;直流电阻(RDC):90mΩ;; LCSC Part Name: 单路 0402磁珠 阻抗120Ω@100MHz; Supplier Part: C96993; Manufacturer: Sunlord(顺络); Supplier Footprint: 0402; JLCPCB Part Class: 扩展库; Datasheet: https://atta.szlcsc.com/upload/public/pdf/source/20210916/3C06D8971A361A4569490E57F6B8A429.pdf; Supplier: LCSC; Impedance @ Frequency: 120Ω@100MHz; Tolerance: ±25%; DC Resistance: 90mΩ; Current Rating: 1.3A; Circuits: 1
LED4 = F.0603.00139/P2-0603R1TS2-06T-002: 发光颜色:红色;正向电流:-;透镜颜色:-;发光角度:120°;工作温度:-40℃~+85℃;; Supplier Part: C7496820; Manufacturer: TUOZHAN(拓展光电); Supplier Footprint: 0603; JLCPCB Part Class: 扩展库; Datasheet: https://atta.szlcsc.com/upload/public/pdf/source/20230809/2283CFC12D1EC1C972D0489FE4CEE0B0.pdf; Supplier: LCSC; Emitted Color: 红色; Viewing Angle: 120°; Operating Temperature: -40℃~+85℃
R17 = 0402WGF220JTCE: 电阻类型:厚膜电阻;阻值:22Ω;精度:±1%;功率:62.5mW;温度系数:±100ppm/℃;; LCSC Part Name: 厚膜电阻 22Ω ±1% 62.5mW; Supplier Part: C25092; Manufacturer: UNI-ROYAL(厚声); Supplier Footprint: 0402; JLCPCB Part Class: Basic Part; Datasheet: https://atta.szlcsc.com/upload/public/pdf/source/20200306/C422600_1E6D84923E4A46A82E41ADD87F860B5C.pdf; Supplier: LCSC; Type: 厚膜电阻; Tolerance: ±1%; Power(Watts): 62.5mW; Temperature Coefficient: ±100ppm/℃; Overload Voltage (Max): 50V; Operating Temperature Range: -55℃~+155℃
R18 R19 = 0402WGF330JTCE: 电阻类型:厚膜电阻;阻值:33Ω;精度:±1%;功率:62.5mW;温度系数:±100ppm/℃;; LCSC Part Name: 厚膜电阻 33Ω ±1% 62.5mW; Supplier Part: C25105; Manufacturer: UNI-ROYAL(厚声); Supplier Footprint: 0402; JLCPCB Part Class: Basic Part; Datasheet: https://atta.szlcsc.com/upload/public/pdf/source/20200306/C422600_1E6D84923E4A46A82E41ADD87F860B5C.pdf; Supplier: LCSC; Type: 厚膜电阻; Tolerance: ±1%; Power(Watts): 62.5mW; Temperature Coefficient: ±100ppm/℃; Overload Voltage (Max): 50V; Operating Temperature Range: -55℃~+155℃
R20 R30 R31 = 0402WGF4701TCE: 电阻类型:厚膜电阻;阻值:4.7kΩ;精度:±1%;功率:62.5mW;温度系数:±100ppm/℃;; LCSC Part Name: 厚膜电阻 4.7kΩ ±1% 62.5mW; Supplier Part: C25900; Manufacturer: UNI-ROYAL(厚声); Supplier Footprint: 0402; JLCPCB Part Class: 基础库; Datasheet: https://atta.szlcsc.com/upload/public/pdf/source/20200306/C422600_1E6D84923E4A46A82E41ADD87F860B5C.pdf; Supplier: LCSC; Type: 厚膜电阻; Tolerance: ±1%; Power(Watts): 62.5mW; Temperature Coefficient: ±100ppm/℃; Overload Voltage (Max): 50V; Operating Temperature Range: -55℃~+155℃
R176 = TC0350F4701T5E_C179829: 温度系数:±50ppm/℃;精度:±1%;阻值:4.7kΩ;功率:1/6W;工作温度范围:-55℃~+155℃;最大工作电压:75V;; LCSC Part Name: 4.7kΩ ±1%; Supplier Part: C179829; Manufacturer: UNI-ROYAL(厚声); Manufacturer Part: TC0350F4701T5E; Supplier Footprint: 0603; Datasheet: https://atta.szlcsc.com/upload/public/pdf/source/20190107/C179829_59D99BA947CB5DBA78EB915107344832.pdf; Supplier: LCSC; Temperature Coefficient: ±50ppm/℃; Tolerance: ±1%; Power(Watts): 1/6W; Operating Temperature Range: -55℃~+155℃; Overload Voltage (Max): 75V
RN1 = 4D02WGJ0330TCE: 阻值:33Ω;精度:±5%;单个元件功率:62.5mW;电阻器数:4;温度系数:±200ppm/℃;; LCSC Part Name: 33Ω ±5%; Supplier Part: C25501; Manufacturer: UNI-ROYAL(厚声); Supplier Footprint: 0402x4; JLCPCB Part Class: 扩展库; Datasheet: https://atta.szlcsc.com/upload/public/pdf/source/20191224/C474318_2527498AE30E813171187CCD28401A71.pdf; Supplier: LCSC; Tolerance: ±5%; Power(Watts): 62.5mW; Number of Resistors: 4; Number of Pins: 8; Temperature Coefficient: ±200ppm/℃
TP11-TP16 = Test-Point: Test Point 测试点
U20 = ZX-SH1.0-8PWT: 参考系列:SH;间距:1mm;插针结构:1x8P;排数:1;每排PIN数:8;行距:-;公母:公型插针;安装方式:卧贴;额定电流:1A;触头材质:黄铜;触头镀层:锡;工作温度范围:-25℃~+85℃;焊接温度(最大值):260℃;; LCSC Part Name: 系列:SH 间距:1mm 1x8P 卧贴; Supplier Part: C7430450; Manufacturer: Megastar(兆星); Supplier Footprint: SMD,P=1mm; JLCPCB Part Class: 扩展库; Datasheet: https://atta.szlcsc.com/upload/public/pdf/source/20230619/1B6A23D99AB40A01DBAA7D7AE5A01F3F.pdf; Supplier: LCSC; Reference Series: SH; Pitch: 1mm; Pins Structure: 1x8P; Number of Rows: 1; Number of PINs Per Row: 8; Gender: 公型插针; Mounting Style: 卧贴; Current Rating (Max): 1A; Contact Material: 黄铜; Contact Plating: 锡; Operating Temperature Range: -25℃~+85℃; Welding Temperature (Max): 260℃
U30 = W25Q64JVSSIQ_C83140: 64M-bit/8M-byte FLASH芯片,SPI接口 133MHz(266/532MHz Dual/Quad-SPI) 比W25Q64FVSSIG更高速度; Supplier Part: C83140; Manufacturer: WINBOND(华邦); Supplier Footprint: SOP-8-208mil; JLCPCB Part Class: 扩展库; Datasheet: https://atta.szlcsc.com/upload/public/pdf/source/20161110/1478742546019.pdf; Supplier: LCSC
X3 = OT322550MJBA4SL: 频率:50MHz;工作电压:1.8V~3.3V;频率稳定度:±10ppm;; Supplier: LCSC; Supplier Part: C717684; Manufacturer: YXC(扬兴晶振); JLCPCB Part Class: Extended Part; LCSC Part Name: 50MHz ±10ppm 1.8V~3.3V YSO110TR; Supplier Footprint: SMD3225-4P; Datasheet: https://atta.szlcsc.com/upload/public/pdf/source/20210329/C669065_30B18CFE780D377BA4E84F6ED1951959.pdf; Supply Voltage: 1.8V~3.3V; Frequency Stability: ±10ppm; Operating Temperature: -40℃~+85℃
CARD2 = TF PUSH: 卡类型:MicroSD卡(TF卡);连接器类型:卡座;卡连接方式:自弹式;本体最大高度:2mm;工作温度范围:-20℃~+90℃;; LCSC Part Name: 自弹式TF卡座 TF外焊式内存卡卡座; Supplier Part: C393941; Manufacturer: SHOU HAN(首韩); Supplier Footprint: SMD; JLCPCB Part Class: 扩展库; Datasheet: https://atta.szlcsc.com/upload/public/pdf/source/20191011/C393941_0DDD896EE907FEB750D8B7B8982E2A67.pdf; Supplier: LCSC; Card Type: MicroSD卡(TF卡); Connector Type: 卡座; Card Connection Mode: 自弹式; Maximum Body Height: 2mm; Operating Temperature Range: -20℃~+90℃

## Nets
+1.5V: C31.2 C32.2 C33.2 C34.2 C35.2 C96.2 C97.2 C98.2 C99.2 C100.2 C101.2 C102.2 C103.2 C104.2 C105.2 C140.2 C141.2 C142.2 L8.2 U29.A1(VDDQ) U29.A8(VDDQ) U29.B2(VDD) U29.C1(VDDQ) U29.C9(VDDQ) U29.D2(VDDQ) U29.D9(VDD) U29.E9(VDDQ) U29.F1(VDDQ) U29.G7(VDD) U29.H2(VDDQ) U29.H9(VDDQ) U29.K2(VDD) U29.K8(VDD) U29.N1(VDD) U29.N9(VDD) U29.R1(VDD) U29.R9(VDD) ; also on sheet 1 5
+3.3V: C57.1 C166.2 CARD2.4(VDD) L9.2 L16.1 R30.1 R31.2 R154.2 R155.2 R176.2 U30.8(VCC) ; also on sheet 1 2 3 4 5
+5V_IN: C21.2 D4.2(A) TP15.1 U20.8 ; also on sheet 1 2 3 5
GND: C21.1 C23.2 C31.1 C32.1 C33.1 C34.1 C35.1 C56.1 C57.2 C68.2 C69.1 C74.2 C75.1 C76.1 C77.2 C81.1 C82.1 C83.1 C84.2 C85.2 C88.2 C89.2 C96.1 C97.1 C98.1 C99.1 C100.1 C101.1 C102.1 C103.1 C104.1 C105.1 C119.1 C134.1 C135.1 C136.1 C137.2 C138.2 C139.2 C140.1 C141.1 C142.1 C166.1 CARD2.6(VSS) CARD2.10 CARD2.11 CARD2.12 CARD2.13 D9.3(GND) D9.8(GND) D10.3(GND) D10.8(GND) D11.3(GND) D11.8(GND) LED4.1(K) R20.1 R76.1 R109.1 R130.1 R131.1 R132.1 R151.1 TP16.1 U20.1 U20.9 U20.10 U23.4(PGND) U23.8(GND) U23.11(EPAD) U29.A9(VSS) U29.B1(VSSQ) U29.B3(VSS) U29.B9(VSSQ) U29.D1(VSSQ) U29.D8(VSSQ) U29.E1(VSS) U29.E2(VSSQ) U29.E8(VSSQ) U29.F9(VSSQ) U29.G1(VSSQ) U29.G8(VSS) U29.G9(VSSQ) U29.J2(VSS) U29.J8(VSS) U29.M1(VSS) U29.M9(VSS) U29.P1(VSS) U29.P9(VSS) U29.T1(VSS) U29.T9(VSS) U30.4(GND) USB3.4(TMDS_DATA2_SHIELD) USB3.7(TMDS_DATA1_SHIELD) USB3.10(TMDS_DATA0_SHIELD) USB3.13(TMDS_CLOCK_SHIELD) USB3.16(DDC/CEC_GND) USB3.20(SHIELD) X3.2(GND) ; also on sheet 1 2 3 4 5
A6_IOR26B_JTAG_TDI: RN1.4 TP14.1 U20.4
A7_IOR26A_JTAG_TCK: R20.2 RN1.3 TP13.1 U20.5
B8_IOR25B_JTAG_TMS: RN1.1 TP11.1 U20.7
C6_IOR25A_JTAG_TDO: RN1.2 TP12.1 U20.6
DDR3_A0: R123.2 U29.N3(A0) ; also on sheet 1
DDR3_A1: R122.2 U29.P7(A1) ; also on sheet 1
DDR3_A2: R121.2 U29.P3(A2) ; also on sheet 1
DDR3_A3: R120.2 U29.N2(A3) ; also on sheet 1
DDR3_A4: R119.1 U29.P8(A4) ; also on sheet 1
DDR3_A5: R118.1 U29.P2(A5) ; also on sheet 1
DDR3_A6: R117.1 U29.R8(A6) ; also on sheet 1
DDR3_A7: R116.1 U29.R2(A7) ; also on sheet 1
DDR3_A8: R115.1 U29.T8(A8) ; also on sheet 1
DDR3_A9: R114.1 U29.R3(A9) ; also on sheet 1
DDR3_A10: R113.1 U29.L7(A10/AP) ; also on sheet 1
DDR3_A11: R112.1 U29.R7(A11) ; also on sheet 1
DDR3_A12: R111.1 U29.N7(A12/BC#) ; also on sheet 1
DDR3_A13: R110.1 U29.T3(A13) ; also on sheet 1
DDR3_BA0: R126.2 U29.M2(BA0) ; also on sheet 1
DDR3_BA1: R125.2 U29.N8(BA1) ; also on sheet 1
DDR3_BA2: R124.2 U29.M3(BA2) ; also on sheet 1
DDR3_CASN: R127.1 U29.K3(CAS#) ; also on sheet 1
DDR3_CK_EN: R131.2 U29.K9(CKE) ; also on sheet 1
DDR3_CKN: R106.2 U29.K7(CK#) ; also on sheet 1
DDR3_CKP: R106.1 U29.J7(CK) ; also on sheet 1
DDR3_CSN: R130.2 U29.L2(CS#) ; also on sheet 1
DDR3_DQ0: U29.E3(DQ0) ; also on sheet 1
DDR3_DQ1: U29.F7(DQ1) ; also on sheet 1
DDR3_DQ2: U29.F2(DQ2) ; also on sheet 1
DDR3_DQ3: U29.F8(DQ3) ; also on sheet 1
DDR3_DQ4: U29.H3(DQ4) ; also on sheet 1
DDR3_DQ5: U29.H8(DQ5) ; also on sheet 1
DDR3_DQ6: U29.G2(DQ6) ; also on sheet 1
DDR3_DQ7: U29.H7(DQ7) ; also on sheet 1
DDR3_DQ8: U29.D7(DQ8) ; also on sheet 1
DDR3_DQ9: U29.C3(DQ9) ; also on sheet 1
DDR3_DQ10: U29.C8(DQ10) ; also on sheet 1
DDR3_DQ11: U29.C2(DQ11) ; also on sheet 1
DDR3_DQ12: U29.A7(DQ12) ; also on sheet 1
DDR3_DQ13: U29.A2(DQ13) ; also on sheet 1
DDR3_DQ14: U29.B8(DQ14) ; also on sheet 1
DDR3_DQ15: U29.A3(DQ15) ; also on sheet 1
DDR3_LDM: U29.E7(LDM) ; also on sheet 1
DDR3_LDQSN: U29.G3(LDQS#) ; also on sheet 1
DDR3_LDQSP: U29.F3(LDQS) ; also on sheet 1
DDR3_ODT: U29.K1(ODT) ; also on sheet 1
DDR3_RASN: R128.1 U29.J3(RAS#) ; also on sheet 1
DDR3_RSTN: R109.2 U29.T2(RESET#) ; also on sheet 1
DDR3_UDM: U29.D3(UDM) ; also on sheet 1
DDR3_UDQSN: U29.B7(UDQS#) ; also on sheet 1
DDR3_UDQSP: U29.C7(UDQS) ; also on sheet 1
DDR3_WEN: R129.1 U29.L3(WE#) ; also on sheet 1
F12_IOT12A_FPGA_TX: R18.2 ; also on sheet 1
F13_IOT8A_FPGA_RX: R19.2 ; also on sheet 1
HDMI_5V: C68.1 C69.2 D4.1(K) R152.2 R153.2 USB3.19(+5V)
HDMI_CLK_N: D10.5(I/O4) D10.6(NC) R150.1 USB3.14(TMDS_CLOCK-)
HDMI_CLK_P: D10.4(I/O3) D10.7(NC) R149.1 USB3.12(TMDS_CLOCK+)
HDMI_DATA0_N: D10.2(I/O2) D10.9(NC) R148.1 USB3.11(TMDS_DATA0-)
HDMI_DATA0_P: D10.1(I/O1) D10.10(NC) R147.1 USB3.9(TMDS_DATA0+)
HDMI_DATA1_N: D9.5(I/O4) D9.6(NC) R146.1 USB3.8(TMDS_DATA1-)
HDMI_DATA1_P: D9.4(I/O3) D9.7(NC) R145.1 USB3.6(TMDS_DATA1+)
HDMI_DATA2_N: D9.2(I/O2) D9.9(NC) R144.1 USB3.5(TMDS_DATA2-)
HDMI_DATA2_P: D9.1(I/O1) D9.10(NC) R143.1 USB3.3(TMDS_DATA2+)
JTAG_TCK: RN1.6 ; also on sheet 1
JTAG_TDI: RN1.5 ; also on sheet 1
JTAG_TDO: RN1.7 ; also on sheet 1
JTAG_TMS: RN1.8 ; also on sheet 1
L10_IOR34B_FLASH_SPI_CLK: R151.2 U30.6(CLK) ; also on sheet 1
LVDS_IOR11_N: R144.2 ; also on sheet 1
LVDS_IOR11_P: R143.2 ; also on sheet 1
LVDS_IOR17_N: R146.2 ; also on sheet 1
LVDS_IOR17_P: R145.2 ; also on sheet 1
LVDS_IOR20_N: R148.2 ; also on sheet 1
LVDS_IOR20_P: R147.2 ; also on sheet 1
LVDS_IOR22_N: R150.2 ; also on sheet 1
LVDS_IOR22_P: R149.2 ; also on sheet 1
M9_IOR34A_FLASH_SPI_CS: U30.1(CS#) ; also on sheet 1
P10_IOR33A_FLASH_SPI_SO: U30.2(DO) ; also on sheet 1
PA15/SPI2_NSS: CARD2.2(CD/DAT3) D11.5(I/O4) D11.6(NC) ; also on sheet 2
PB3/SPI2_SCK: CARD2.5(CLX) D11.2(I/O2) D11.9(NC) ; also on sheet 2
PB4/SPI2_MISO: CARD2.7(DAT0) D11.1(I/O1) D11.10(NC) ; also on sheet 2
PB5/SPI2_MOSI: CARD2.3(CMD) D11.4(I/O3) D11.7(NC) ; also on sheet 2
R10_IOR33B_FLASH_SPI_SI: U30.5(DI) ; also on sheet 1
T7_IOR29A_OSC50M: R17.2 ; also on sheet 1
VREF_DRAM: C77.1 C88.1 C89.1 U23.6(REFOUT) U29.H1(VREFDQ) U29.M8(VREFCA)
VTT_DRAM: C23.1 C81.2 C82.2 C83.2 C84.1 C85.1 C134.2 C135.2 C136.2 C137.1 C138.1 C139.1 R110.2 R111.2 R112.2 R113.2 R114.2 R115.2 R116.2 R117.2 R118.2 R119.2 R120.1 R121.1 R122.1 R123.1 R124.1 R125.1 R126.1 R127.2 R128.2 R129.2 U23.3(VO) U23.5(VOSNS)
$7N7102: R132.2 U29.L8(ZQ)
$8N1049: C75.2 C76.2 L8.1 R75.2 U23.2(VLDOIN)
$8N1062: C119.2 R75.1 R76.2 U23.1(REFIN)
$8N1063: R74.2 U23.9(PGOOD)
$8N1065: R73.2 U23.7(EN)
$8N1066: C74.1 L9.1 R73.1 R74.1 U23.10(VIN)
$9N404: R18.1 U20.3
$9N405: R19.1 U20.2
$9N984: R17.1 X3.3(OUTPUT)
$9N1319: R31.1 U30.3(IO2)
$9N1466: R30.2 U30.7(IO3)
$9N4193: C56.2 L16.2 X3.1(TRI) X3.4(VDD)
$9N9225: LED4.2(A) R176.1
$10N4535: R155.1 USB3.1(HOT_PLUG_DET)
$10N4604: R152.1 USB3.18(SDA)
$10N4657: R153.1 USB3.17(SCL)
$10N4710: R154.1 USB3.15(CEC)

Not connected (* = marked no-connect by the designer): CARD2 1(DAT2)* 8(DAT1)* CD*; U29 J1(NC)* J9(NC)* L1(NC)* L9(NC)* M7(NC)* T7(NC)*; USB3 2(UTILITY)*

## Notes on the sheets
sheet 6
- DDR3
sheet 7
- 线性终端稳压器
sheet 8
- Power 指示灯
- JTAG下载接口
- 晶振电路
- SPI-NORFLASH
sheet 11
- VCCPLLL
- +1.0V
- VCCPLLR
- +1.5V
- VTT_DRAM
- +5V_IN
- +3.3V
